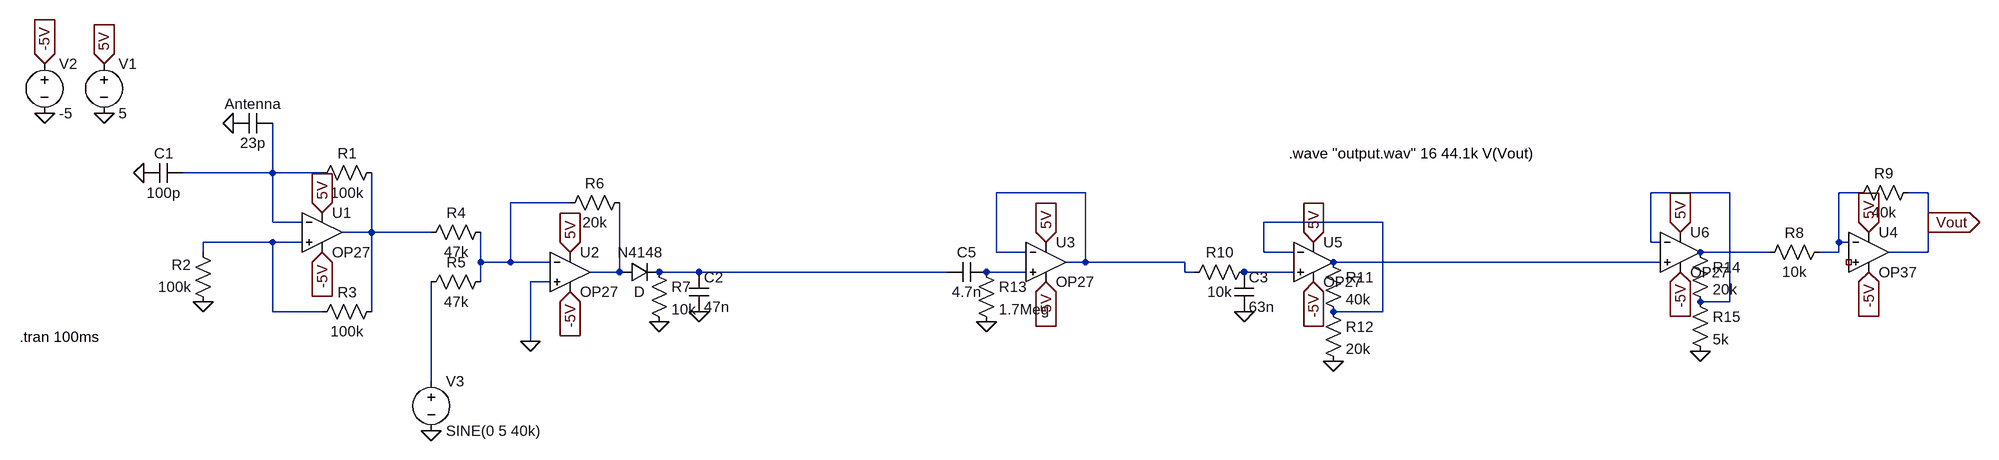
[diagram p0: schematic initial.asc]
initial.asc, the LTspice schematic file:
Version 4
SHEET 1 2800 680
WIRE 96 48 96 -32
WIRE 96 48 -48 48
WIRE 176 48 96 48
WIRE 1408 80 1264 80
WIRE 2448 80 2320 80
WIRE 2656 80 2624 80
WIRE 2768 80 2736 80
WIRE 576 96 480 96
WIRE 96 128 96 48
WIRE 144 128 96 128
WIRE 1888 128 1696 128
WIRE 2768 128 2768 80
WIRE 256 144 256 48
WIRE 256 144 208 144
WIRE 352 144 256 144
WIRE 96 160 -16 160
WIRE 144 160 96 160
WIRE 2320 160 2320 80
WIRE 2336 160 2320 160
WIRE 2624 160 2624 80
WIRE 2640 160 2624 160
WIRE -16 176 -16 160
WIRE 1264 176 1264 80
WIRE 1312 176 1264 176
WIRE 1696 176 1696 128
WIRE 1744 176 1696 176
WIRE 2512 176 2400 176
WIRE 2624 176 2624 160
WIRE 2624 176 2592 176
WIRE 2768 176 2768 128
WIRE 2768 176 2704 176
WIRE 432 192 432 144
WIRE 480 192 480 96
WIRE 480 192 432 192
WIRE 544 192 480 192
WIRE 1408 192 1408 80
WIRE 1408 192 1376 192
WIRE 1568 192 1408 192
WIRE 2336 192 1808 192
WIRE 656 208 656 96
WIRE 656 208 608 208
WIRE 784 208 720 208
WIRE 1184 208 784 208
WIRE 1312 208 1248 208
WIRE 1568 208 1568 192
WIRE 1584 208 1568 208
WIRE 1744 208 1664 208
WIRE 432 224 432 192
WIRE 544 224 512 224
WIRE 2448 256 2448 80
WIRE 2448 256 2400 256
WIRE 96 272 96 160
WIRE 176 272 96 272
WIRE 256 272 256 144
WIRE 1888 272 1888 128
WIRE 1888 272 1808 272
WIRE 512 320 512 224
WIRE 352 384 352 224
FLAG -272 -48 0
FLAG -176 -48 0
FLAG -176 -128 5V
IOPIN -176 -128 In
FLAG -272 -128 -5V
IOPIN -272 -128 In
FLAG 176 176 -5V
IOPIN 176 176 In
FLAG 176 112 5V
IOPIN 176 112 In
FLAG -112 48 0
FLAG -16 256 0
FLAG 352 464 0
FLAG 576 240 -5V
IOPIN 576 240 In
FLAG 576 176 5V
IOPIN 576 176 In
FLAG 512 320 0
FLAG 784 272 0
FLAG 720 288 0
FLAG 2672 208 -5V
IOPIN 2672 208 In
FLAG 2672 144 5V
IOPIN 2672 144 In
FLAG 32 -32 0
FLAG 2768 128 Vout
IOPIN 2768 128 Out
FLAG 1664 272 0
FLAG 1776 224 -5V
IOPIN 1776 224 In
FLAG 1776 160 5V
IOPIN 1776 160 In
FLAG 1808 352 0
FLAG 1248 288 0
FLAG 1344 224 -5V
IOPIN 1344 224 In
FLAG 1344 160 5V
IOPIN 1344 160 In
FLAG 2368 144 5V
IOPIN 2368 144 In
FLAG 2368 208 -5V
IOPIN 2368 208 In
FLAG 2400 336 0
SYMBOL OpAmps\\OP27 176 80 R0
SYMATTR InstName U1
SYMBOL voltage -176 -144 R0
SYMATTR InstName V1
SYMATTR Value 5
SYMBOL voltage -272 -144 R0
SYMATTR InstName V2
SYMATTR Value -5
SYMBOL cap -48 32 R90
WINDOW 0 0 32 VBottom 2
WINDOW 3 32 32 VTop 2
SYMATTR InstName C1
SYMATTR Value 100p
SYMBOL res 272 32 R90
WINDOW 0 0 56 VBottom 2
WINDOW 3 32 56 VTop 2
SYMATTR InstName R1
SYMATTR Value 100k
SYMBOL res 0 272 R180
WINDOW 0 36 76 Left 2
WINDOW 3 36 40 Left 2
SYMATTR InstName R2
SYMATTR Value 100k
SYMBOL res 272 256 R90
WINDOW 0 0 56 VBottom 2
WINDOW 3 32 56 VTop 2
SYMATTR InstName R3
SYMATTR Value 100k
SYMBOL res 448 128 R90
WINDOW 0 0 56 VBottom 2
WINDOW 3 32 56 VTop 2
SYMATTR InstName R4
SYMATTR Value 47k
SYMBOL res 448 208 R90
WINDOW 0 0 56 VBottom 2
WINDOW 3 32 56 VTop 2
SYMATTR InstName R5
SYMATTR Value 47k
SYMBOL voltage 352 368 R0
WINDOW 123 0 0 Left 0
WINDOW 39 0 0 Left 0
SYMATTR InstName V3
SYMATTR Value SINE(0 5 40k)
SYMBOL OpAmps\\OP27 576 144 R0
SYMATTR InstName U2
SYMBOL res 672 80 R90
WINDOW 0 0 56 VBottom 2
WINDOW 3 32 56 VTop 2
SYMATTR InstName R6
SYMATTR Value 20k
SYMBOL diode 656 224 R270
WINDOW 0 32 32 VTop 2
WINDOW 3 0 32 VBottom 2
SYMATTR InstName N4148
SYMBOL res 704 192 R0
SYMATTR InstName R7
SYMATTR Value 10k
SYMBOL cap 768 208 R0
SYMATTR InstName C2
SYMATTR Value 47n
SYMBOL res 2608 160 R90
WINDOW 0 0 56 VBottom 2
WINDOW 3 32 56 VTop 2
SYMATTR InstName R8
SYMATTR Value 10k
SYMBOL res 2752 64 R90
WINDOW 0 0 56 VBottom 2
WINDOW 3 32 56 VTop 2
SYMATTR InstName R9
SYMATTR Value 40k
SYMBOL OpAmps\\OP37 2672 112 R0
SYMATTR InstName U4
SYMBOL cap 96 -48 R90
WINDOW 0 0 32 VBottom 2
WINDOW 3 32 32 VTop 2
SYMATTR InstName Antenna
SYMATTR Value 23p
SYMBOL res 1680 192 R90
WINDOW 0 0 56 VBottom 2
WINDOW 3 32 56 VTop 2
SYMATTR InstName R10
SYMATTR Value 10k
SYMBOL cap 1648 208 R0
SYMATTR InstName C3
SYMATTR Value 63n
SYMBOL OpAmps\\OP27 1776 128 R0
SYMATTR InstName U5
SYMBOL res 1792 176 R0
SYMATTR InstName R11
SYMATTR Value 40k
SYMBOL res 1792 256 R0
SYMATTR InstName R12
SYMATTR Value 20k
SYMBOL cap 1248 192 R90
WINDOW 0 0 32 VBottom 2
WINDOW 3 32 32 VTop 2
SYMATTR InstName C5
SYMATTR Value 4.7n
SYMBOL res 1232 192 R0
SYMATTR InstName R13
SYMATTR Value 1.7Meg
SYMBOL OpAmps\\OP27 1344 128 R0
SYMATTR InstName U3
SYMBOL OpAmps\\OP27 2368 112 R0
SYMATTR InstName U6
SYMBOL res 2384 160 R0
SYMATTR InstName R14
SYMATTR Value 20k
SYMBOL res 2384 240 R0
SYMATTR InstName R15
SYMATTR Value 5k
TEXT -312 312 Left 2 !.tran 100ms
TEXT 1736 16 Left 2 !.wave "output.wav" 16 44.1k V(Vout)

The netlist it stands for:
* initial.asc
XU1 N008 N001 5V -5V N007 OP27  ; pins In+ In- V+ V- OUT
V1 5V 0 5
V2 -5V 0 -5
C1 N001 0 100p
R1 N007 N001 100k
R2 0 N008 100k
R3 N007 N008 100k
R4 N005 N007 47k
R5 N005 N015 47k
V3 N015 0 SINE(0 5 40k)
XU2 0 N005 5V -5V N011 OP27  ; pins In+ In- V+ V- OUT
R6 N011 N005 20k
D§N4148 N011 N012 D
R7 N012 0 10k
C2 N012 0 47n
R8 N004 N009 10k
R9 Vout N004 40k
XU4 NC_01 N004 5V -5V Vout LT1037  ; OP37, pins In+ In- V+ V- OUT
C§Antenna N001 0 23p
R10 N014 N002 10k
C3 N014 0 63n
XU5 N014 N006 5V -5V N010 OP27  ; pins In+ In- V+ V- OUT
R11 N010 N006 40k
R12 N006 0 20k
C5 N013 N012 4.7n
R13 N013 0 1.7Meg
XU3 N013 N002 5V -5V N002 OP27  ; pins In+ In- V+ V- OUT
XU6 N010 N003 5V -5V N009 OP27  ; pins In+ In- V+ V- OUT
R14 N009 N003 20k
R15 N003 0 5k
.model D D
.lib standard.dio
.tran 100ms
.wave "output.wav" 16 44.1k V(Vout)
.lib ADI.lib
.lib LTC.lib
.backanno
.end